# EAGLE schematic RPi-template-B+_small (EAGLE 6.4)
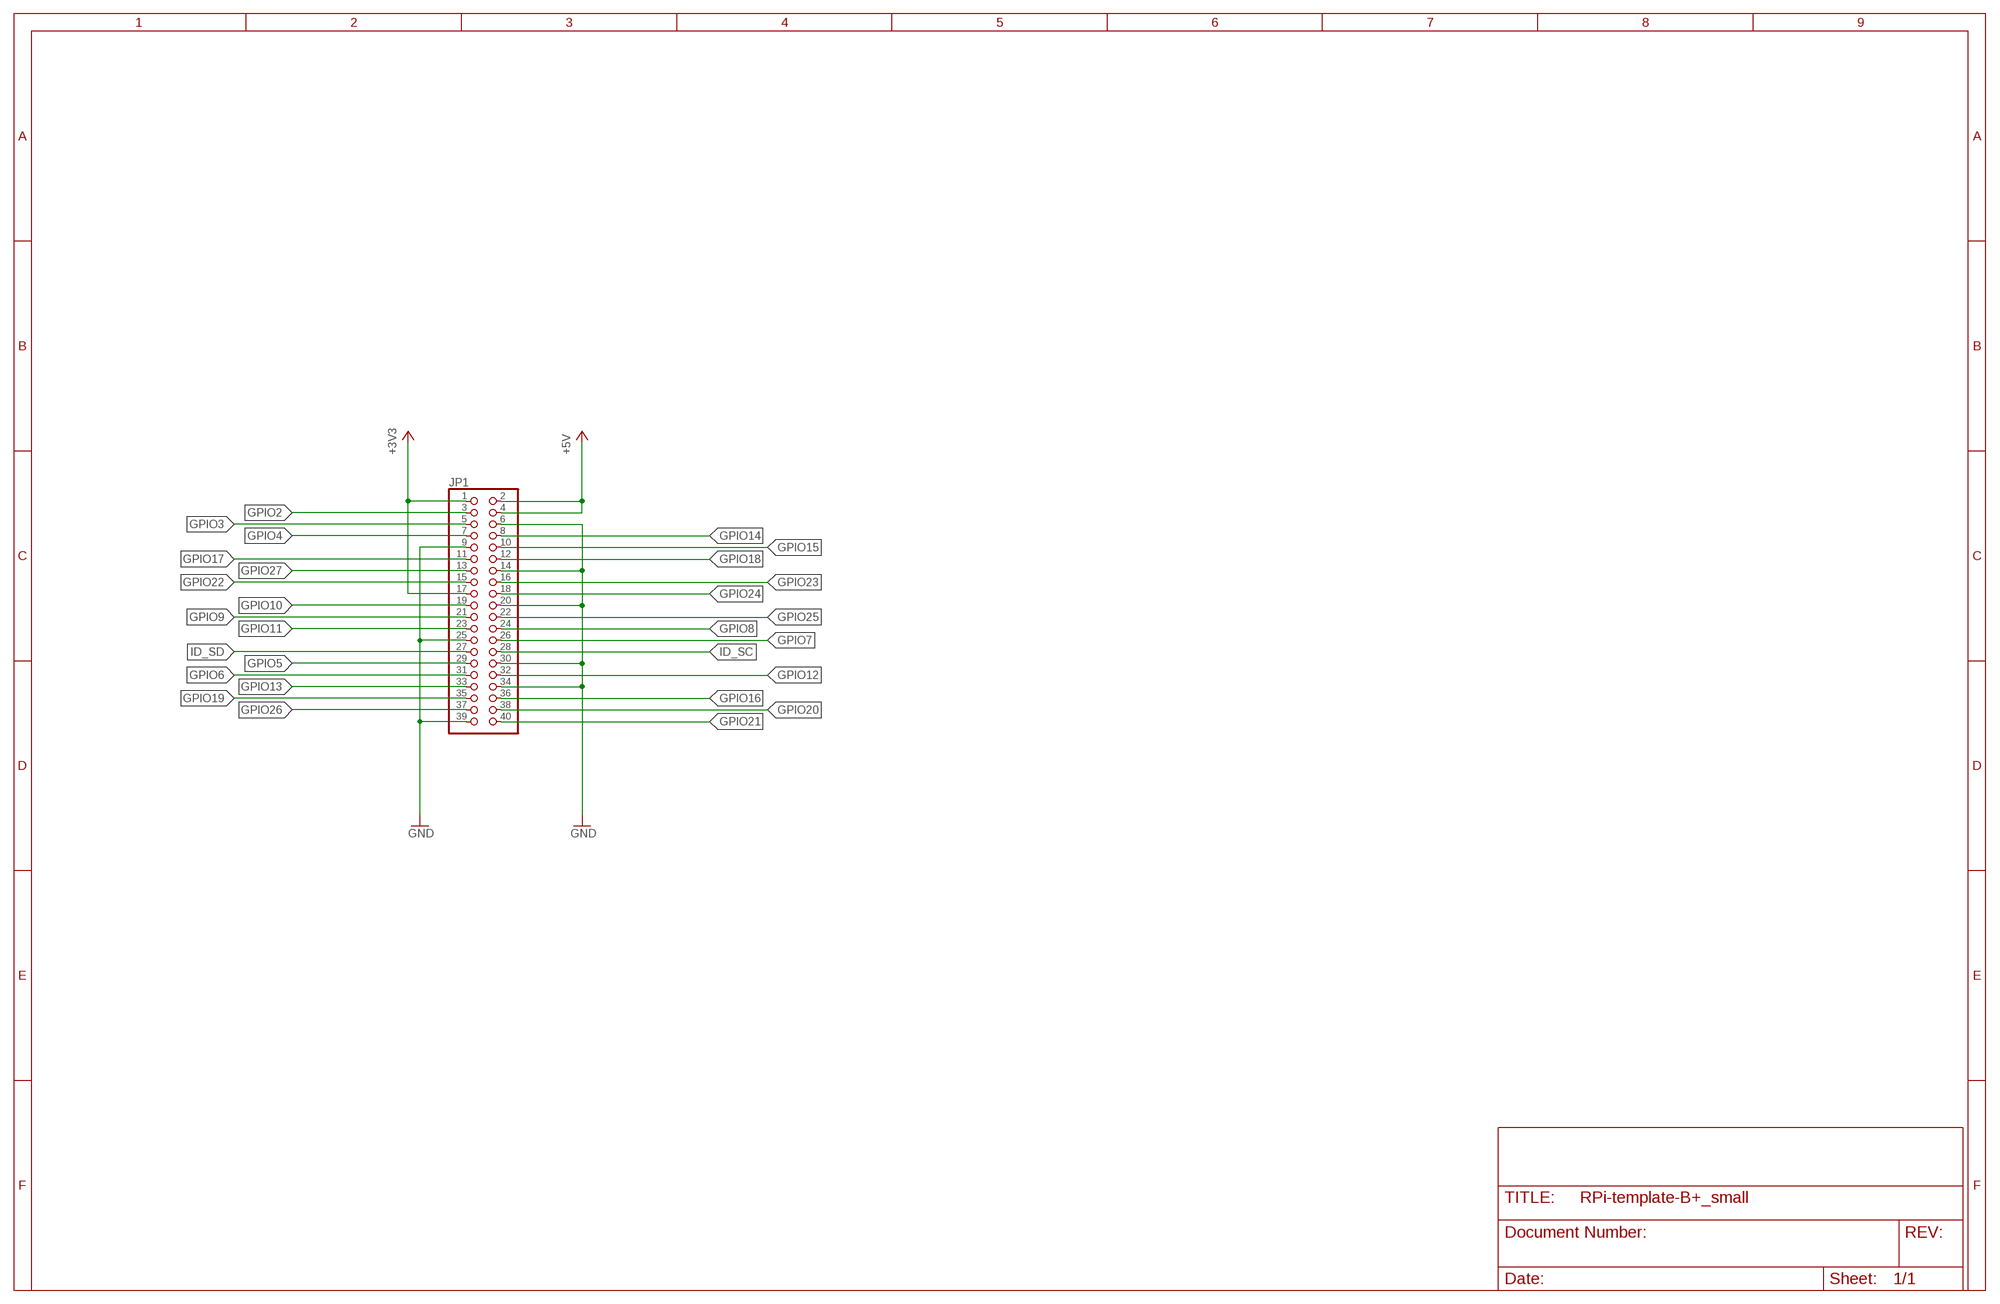
[diagram p0: schematic, sheet 1]

## Parts
JP1  PINHD-2X20  [2X20]

## Nets
+3V3: JP1.1 JP1.17
+5V: JP1.2 JP1.4
GND: JP1.6 JP1.9 JP1.14 JP1.20 JP1.25 JP1.30 JP1.34 JP1.39
GPIO2: JP1.3
GPIO3: JP1.5
GPIO4: JP1.7
GPIO5: JP1.29
GPIO6: JP1.31
GPIO7: JP1.26
GPIO8: JP1.24
GPIO9: JP1.21
GPIO10: JP1.19
GPIO11: JP1.23
GPIO12: JP1.32
GPIO13: JP1.33
GPIO14: JP1.8
GPIO15: JP1.10
GPIO16: JP1.36
GPIO17: JP1.11
GPIO18: JP1.12
GPIO19: JP1.35
GPIO20: JP1.38
GPIO21: JP1.40
GPIO22: JP1.15
GPIO23: JP1.16
GPIO24: JP1.18
GPIO25: JP1.22
GPIO26: JP1.37
GPIO27: JP1.13
ID_SC: JP1.28
ID_SD: JP1.27

## Library data of the parts
JP1 = pinhead:PINHD-2X20: PIN HEADER